# EAGLE design Water_ECMeter-M0 (EAGLE 7.2.0)
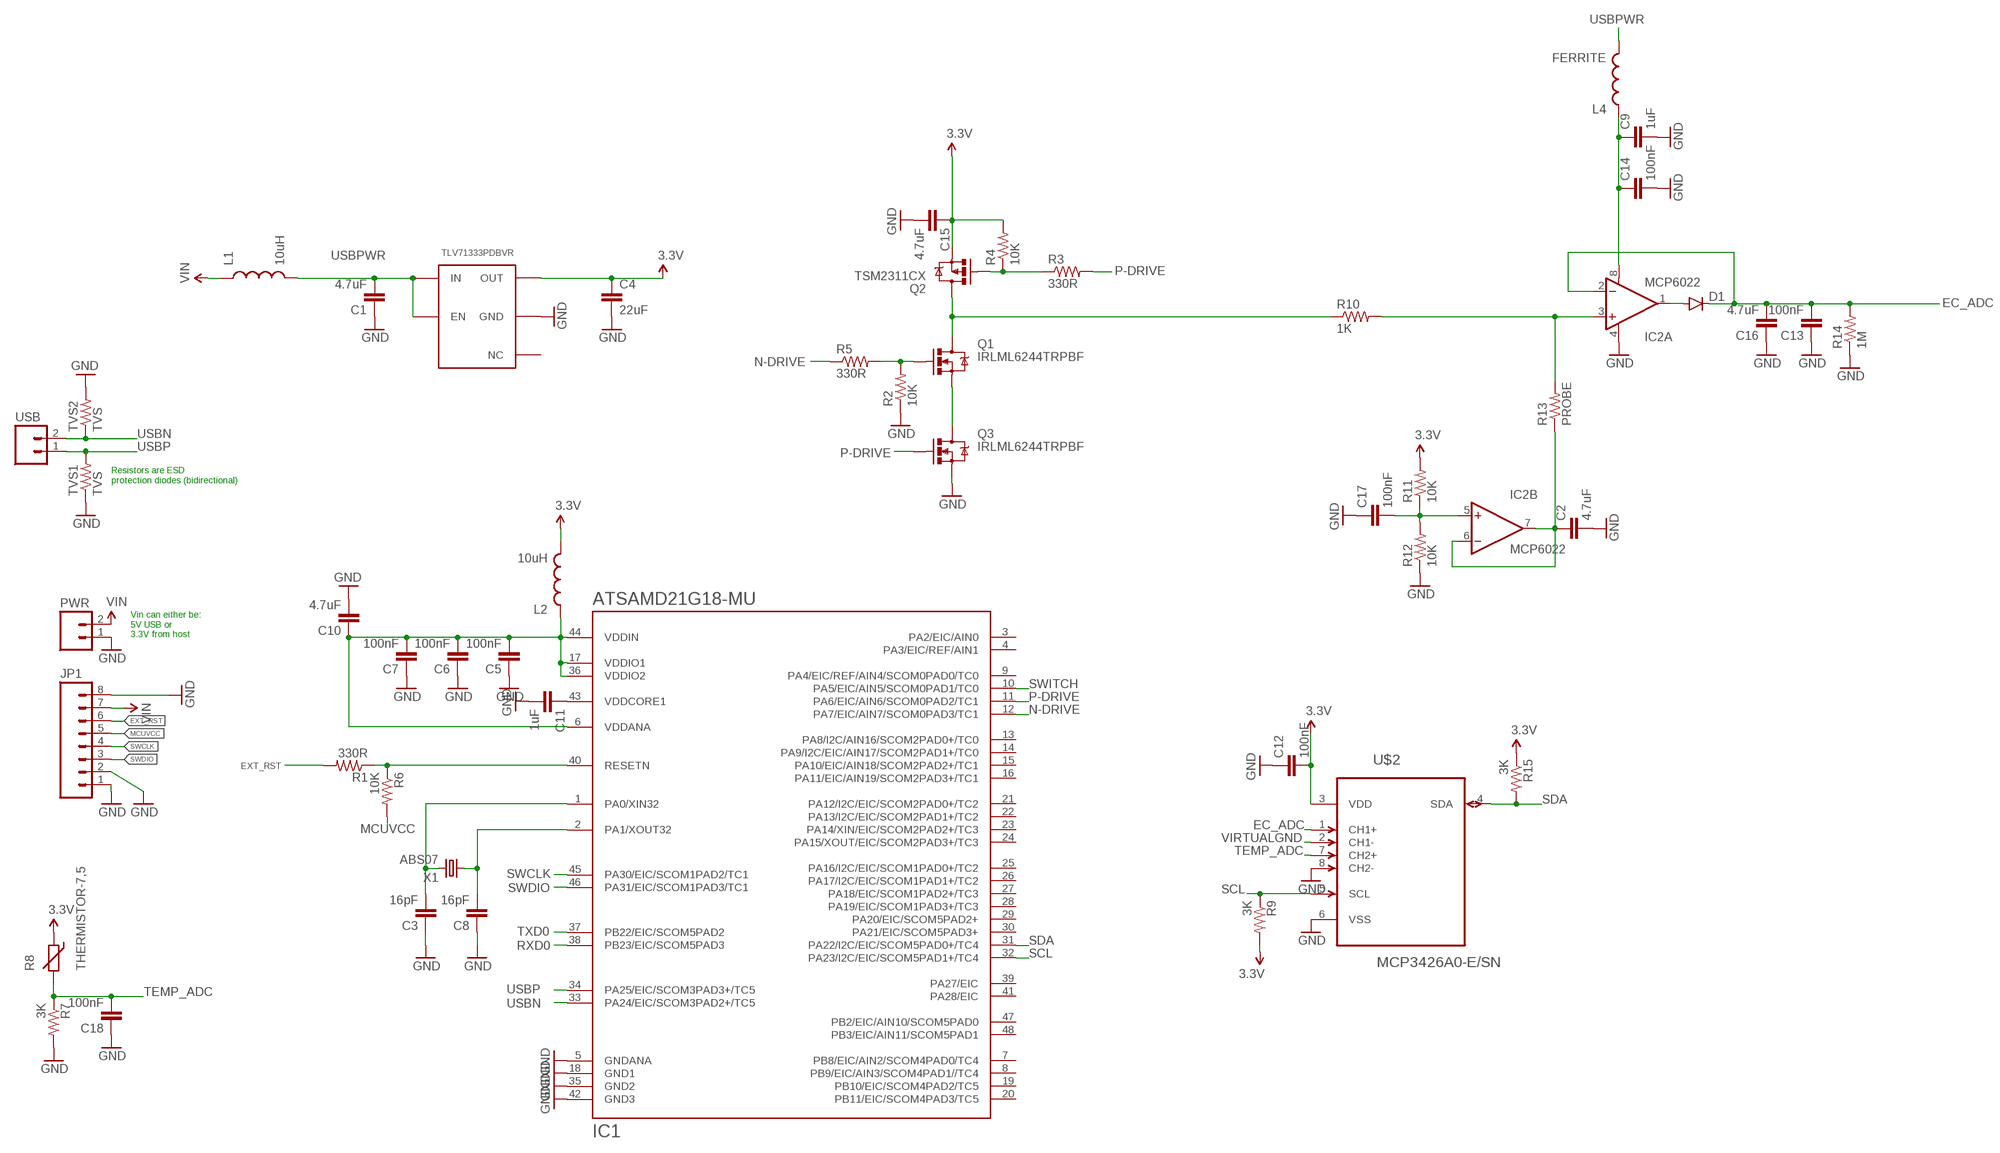
[diagram p0: schematic, sheet 1]

## Parts
C1  4.7uF  CAP0603-CAP  [0603-CAP]
C2  4.7uF  CAP0603-CAP  [0603-CAP]
C3  16pF  CAP0402-CAP  [0402-CAP]
C4  22uF  CAP1206  [1206]
C5  100nF  CAP0402-CAP  [0402-CAP]
C6  100nF  CAP0402-CAP  [0402-CAP]
C7  100nF  CAP0402-CAP  [0402-CAP]
C8  16pF  CAP0402-CAP  [0402-CAP]
C9  1uF  CAP0402-CAP  [0402-CAP]
C10  4.7uF  CAP0603-CAP  [0603-CAP]
C11  1uF  CAP0402-CAP  [0402-CAP]
C12  100nF  CAP0402-CAP  [0402-CAP]
C13  100nF  CAP0402-CAP  [0402-CAP]
C14  100nF  CAP0402-CAP  [0402-CAP]
C15  4.7uF  CAP0603-CAP  [0603-CAP]
C16  4.7uF  CAP0603-CAP  [0603-CAP]
C17  100nF  CAP0402-CAP  [0402-CAP]
C18  100nF  CAP0402-CAP  [0402-CAP]
D1  DIODESOD123  [SOD-123]
IC1  ATSAMD21G18-MU  [QFN48]
IC2  MCP6022  OPAMP-DUALU  [SO08]
JP1  M08  [1X08_ROUND]
L1  10uH  INDUCTOR0603  [0603]
L2  10uH  INDUCTOR0603  [0603]
L4  FERRITE  INDUCTOR0603  [0603]
PWR  M02LOCK_LONGPADS  [1X02_LOCK_LONGPADS]
Q1  IRLML6244TRPBF  MOSFET-NCHANNELAO3404A  [SOT23-3]
Q2  TSM2311CX  MOSFET-PCHANNEL  [SOT23-3]
Q3  IRLML6244TRPBF  MOSFET-NCHANNELAO3404A  [SOT23-3]
R1  330R  RESISTOR0402-RES  [0402-RES]
R2  10K  RESISTOR0402-RES  [0402-RES]
R3  330R  RESISTOR0402-RES  [0402-RES]
R4  10K  RESISTOR0402-RES  [0402-RES]
R5  330R  RESISTOR0402-RES  [0402-RES]
R6  10K  RESISTOR0402-RES  [0402-RES]
R7  3K  RESISTOR0402-RES  [0402-RES]
R8  THERMISTOR-7,5  [R-7,5]
R9  3K  RESISTOR0402-RES  [0402-RES]
R10  1K  RESISTOR0805-RES  [0805]
R11  10K  RESISTOR0402-RES  [0402-RES]
R12  10K  RESISTOR0402-RES  [0402-RES]
R13  PROBE  RESISTORPTH-1W  [AXIAL-0.6]
R14  1M  RESISTOR0402-RES  [0402-RES]
R15  3K  RESISTOR0402-RES  [0402-RES]
TVS1  TVS  RESISTOR0402-RES  [0402-RES]
TVS2  TVS  RESISTOR0402-RES  [0402-RES]
U$1  TLV71333PDBVR  [TLV71333PDBVR]
U$2  MCP3426A0-E/SN  [SOIC127P600X175-8N]
USB  M02LOCK_LONGPADS  [1X02_LOCK_LONGPADS]
X1  ABS07  [ABS07]

## Nets
3.3V: C4.1 C12.2 C15.1 L2.2 Q2.2(S) R4.2 R8.1 R9.2 R11.2 R15.1 U$1.P$5(OUT) U$2.3(VDD)
EC_ADC: C13.2 C16.2 D1.C IC2.2(A:-IN) R14.2 U$2.1(CH1+)
EXT_RST: JP1.6 R1.2
GND: C1.1 C2.2 C3.1 C4.2 C5.1 C6.1 C7.1 C8.1 C9.2 C10.2 C11.2 C12.1 C13.1 C14.2 C15.2 C16.1 C17.1 C18.1 IC1.5(GNDANA) IC1.18(GND1) IC1.35(GND2) IC1.42(GND3) IC2.4(A:V-) JP1.1 JP1.2 JP1.8 PWR.1 Q3.2(S) R2.1 R7.2 R12.1 R14.1 TVS1.1 TVS2.2 U$1.P$2(GND) U$2.6(VSS) U$2.8(CH2-)
MCUVCC: C5.2 C6.2 C7.2 C10.1 IC1.6(VDDANA) IC1.17(VDDIO1) IC1.36(VDDIO2) IC1.44(VDDIN) JP1.5 L2.1 R6.2
N$1: D1.A IC2.1(A:OUT)
N$2: IC1.40(RESETN) R1.1 R6.1
N$3: C3.2 IC1.1(PA0/XIN32) X1.P$2
N$4: C11.1 IC1.43(VDDCORE1)
N$5: C8.2 IC1.2(PA1/XOUT32) X1.P$1
N$6: Q2.1(G) R3.1 R4.1
N$7: Q1.2(S) Q3.3(D)
N$8: Q1.3(D) Q2.3(D) R10.1
N$9: Q1.1(G) R2.2 R5.2
N$13: IC2.3(A:+IN) R10.2 R13.P$2
N$14: C17.2 IC2.5(B:+IN) R11.1 R12.2
N$16: C9.1 C14.1 IC2.8(A:V+) L4.1
N-DRIVE: IC1.12(PA7/EIC/AIN7/SCOM0PAD3/TC1) R5.1
P-DRIVE: IC1.11(PA6/EIC/AIN6/SCOM0PAD2/TC1) Q3.1(G) R3.2
RXD0: IC1.38(PB23/EIC/SCOM5PAD3)
SCL: IC1.32(PA23/I2C/EIC/SCOM5PAD1+/TC4) R9.1 U$2.5(SCL)
SDA: IC1.31(PA22/I2C/EIC/SCOM5PAD0+/TC4) R15.2 U$2.4(SDA)
SWCLK: IC1.45(PA30/EIC/SCOM1PAD2/TC1) JP1.4
SWDIO: IC1.46(PA31/EIC/SCOM1PAD3/TC1) JP1.3
SWITCH: IC1.10(PA5/EIC/AIN5/SCOM0PAD1/TC0)
TEMP_ADC: C18.2 R7.1 R8.2 U$2.7(CH2+)
TXD0: IC1.37(PB22/EIC/SCOM5PAD2)
USBN: IC1.33(PA24/EIC/SCOM3PAD2+/TC5) TVS2.1 USB.2
USBP: IC1.34(PA25/EIC/SCOM3PAD3+/TC5) TVS1.2 USB.1
USBPWR: C1.2 L1.2 L4.2 U$1.P$1(IN) U$1.P$3(EN)
VIN: JP1.7 L1.1 PWR.2
VIRTUALGND: C2.1 IC2.6(B:-IN) IC2.7(B:OUT) R13.P$1 U$2.2(CH1-)
Unconnected: IC1.3(PA2/EIC/AIN0) IC1.4(PA3/EIC/REF/AIN1) IC1.7(PB8/EIC/AIN2/SCOM4PAD0/TC4) IC1.8(PB9/EIC/AIN3/SCOM4PAD1//TC4) IC1.9(PA4/EIC/REF/AIN4/SCOM0PAD0/TC0) IC1.13(PA8/I2C/AIN16/SCOM2PAD0+/TC0) IC1.14(PA9/I2C/EIC/AIN17/SCOM2PAD1+/TC0) IC1.15(PA10/EIC/AIN18/SCOM2PAD2+/TC1) IC1.16(PA11/EIC/AIN19/SCOM2PAD3+/TC1) IC1.19(PB10/EIC/SCOM4PAD2/TC5) IC1.20(PB11/EIC/SCOM4PAD3/TC5) IC1.21(PA12/I2C/EIC/SCOM2PAD0+/TC2) IC1.22(PA13/I2C/EIC/SCOM2PAD1+/TC2) IC1.23(PA14/XIN/EIC/SCOM2PAD2+/TC3) IC1.24(PA15/XOUT/EIC/SCOM2PAD3+/TC3) IC1.25(PA16/I2C/EIC/SCOM1PAD0+/TC2) IC1.26(PA17/I2C/EIC/SCOM1PAD1+/TC2) IC1.27(PA18/EIC/SCOM1PAD2+/TC3) IC1.28(PA19/EIC/SCOM1PAD3+/TC3) IC1.29(PA20/EIC/SCOM5PAD2+) IC1.30(PA21/EIC/SCOM5PAD3+) IC1.39(PA27/EIC) IC1.41(PA28/EIC) IC1.47(PB2/EIC/AIN10/SCOM5PAD0) IC1.48(PB3/EIC/AIN11/SCOM5PAD1) U$1.P$4(NC)

## Notes on the sheet
- Resistors are ESD
  protection diodes (bidirectional)
- Vin can either be:
  5V USB or
  3.3V from host

## Library data of the parts
C1-C3 C5-C18 = SparkFun-Passives:CAP: Capacitor Standard 0603 ceramic capacitor, and 0.1" leaded capacitor.
C4 = SparkFun-Capacitors:CAP: Capacitor Standard 0603 ceramic capacitor, and 0.1" leaded capacitor.
D1 = SparkFun-DiscreteSemi:DIODE: Diode These are standard reverse protection diodes and small signal diodes. SMA package can handle up to about 1A. SOD-323 can handle about 200mA. What the SOD-323 package when ordering, there are some mfgs out there that are 5-pin packages.
IC1 = gknff:ATSAMD21G18
IC2 = SparkFun-AnalogIC:OPAMP-DUAL: Generic op-amp footprint
JP1 = SparkFun-Connectors:M08: Header 8 Standard 8-pin 0.1" header. Use with straight break away headers (SKU : PRT-00116), right angle break away headers (PRT-00553), swiss pins (PRT-00743), machine pins (PRT-00117), and female headers (PRT-00115).
L1 L2 L4 = SparkFun-Passives:INDUCTOR: Inductors Basic Inductor/Choke - 0603 and 1206. Footprints are not proven and vary greatly between part numbers. INDUCTOR POWER 3.3UH 4.0A SMD 0.197" L x 0.197" W x 0.177" H (5.00mm x 5.00mm x 4.50mm)
PWR USB = SparkFun-Connectors:M02: Standard 2-pin 0.1" header. Use with - straight break away headers ( PRT-00116) - right angle break away headers (PRT-00553) - swiss pins (PRT-00743) - machine pins (PRT-00117) - female headers (PRT-00115) Molex polarized connector foot print use with: PRT-08233 with associated crimp pins and housings. 2.54_SCREWTERM for use with PRT-10571. 3.5mm Screw Terminal footprints for PRT-08084 5mm Screw Terminal footprints for use with PRT-08432
Q1 Q3 = SparkFun-DiscreteSemi:MOSFET-NCHANNEL: Common NMOSFET Parts MFG P/N Store ID Prod ID FDD8780 TRANS-09984 SI7820DN TRANS-11055 FDS6630A IC-08089 2N7002PW TRANS-11151 FQP30N06L COM-10213 TRANS-10060 BSS123LT1G TRANS-08345 BSS138 TRANS-00830 BS170 2N7000; PROD_ID: TRAN-12988
Q2 = SparkFun-DiscreteSemi:MOSFET-PCHANNEL: Generic PMOSFET IRLML2244 - TRANS-11153 (SOT-23 -20V -4.3A) (1.Gate 2.Source 3.Drain) FQP27P06 - COM-10349 <http://www.sparkfun.com/products/10349> (TO-220 -60V -27A) (1.Gate 2.Source 3.Drain); PROD_ID: TRANS-08285
R1-R7 R9-R15 TVS1 TVS2 = SparkFun-Passives:RESISTOR: Resistor Basic schematic elements and footprints for 0603, 1206, and PTH resistors.
R8 = varistor:THERMISTOR: THERMISTOR
U$1 = m2m4all:TLV71333PDBVR
U$2 = m2m4all:MCP3426A0-E/SN: Analog-to-Digital Converter; MPN: MCP3426A0-E/SN; OC_FARNELL: 1825012; OC_NEWARK: 52R9954; PACKAGE: SOIC-8; SUPPLIER: Microchip
X1 = m2m4all:ABS07

## Board
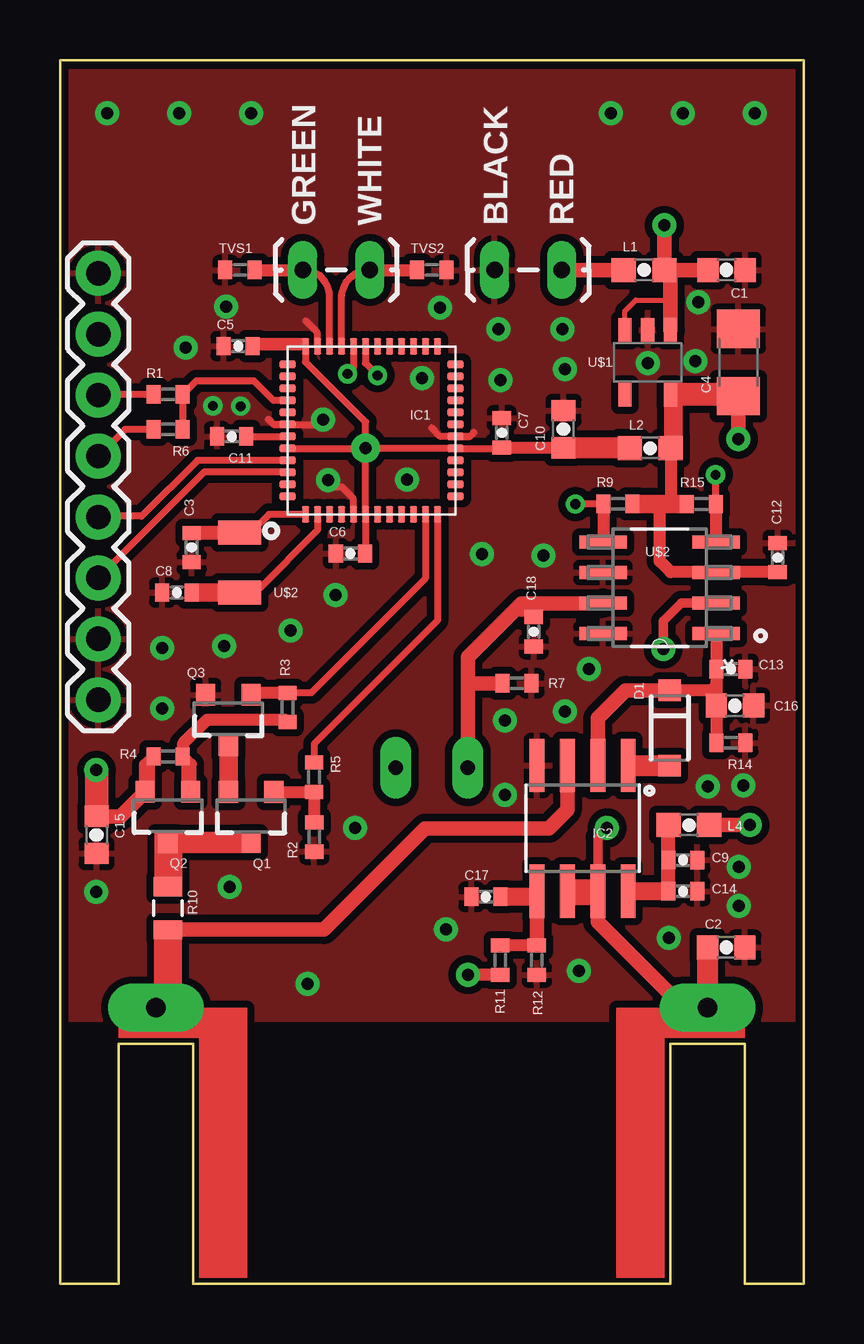
[diagram p1: board, top side]
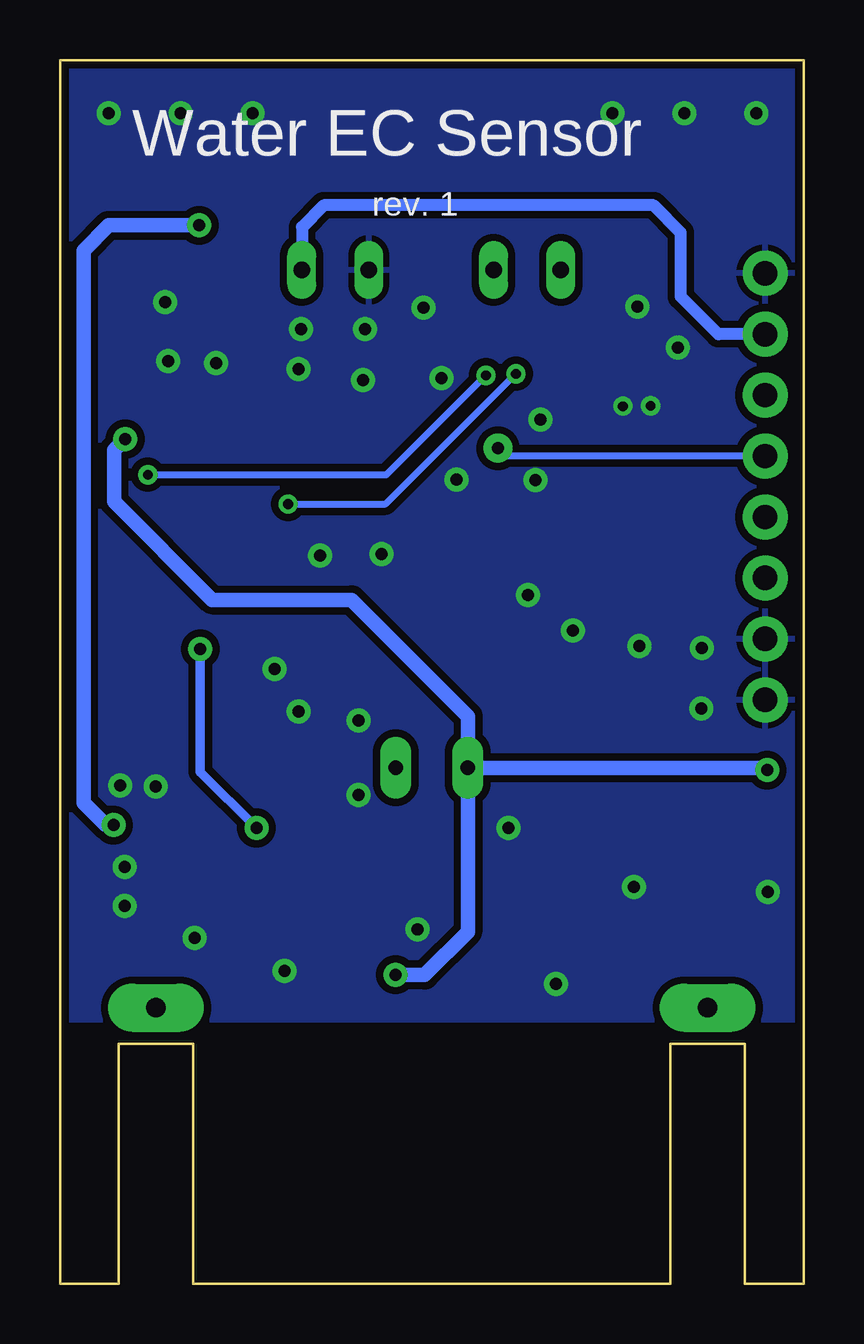
[diagram p2: board, bottom side, seen from below]

Size 31 x 51 mm. Coordinates in mm from the lower left corner, seen from the top.
Outline: 5.55,0 25.45,0 25.45,10 28.55,10 28.55,0 31,0 31,51 0,51 0,0 2.45,0 2.45,10 5.55,10 5.55,0
Copper layers (1*16): Top 0.035mm / dielectric 1.5mm / Bottom 0.035mm
Design rules "default *": minimum track width 10mil, minimum drill 24mil, track to track 12mil, track to pad 12mil, pad to pad 12mil, via to via 12mil, smd to smd 12mil, copper to edge 12mil, drill to drill 8mil, minimum pad ring 10mil, minimum via ring 8mil, stop-mask expansion 4mil, vias tented up to drill 20mil, thermal gap 10mil

### Footprints (pad centres in the part's own frame; a part is rotated, then mirrored left to right if it is on the bottom)
0603-CAP = smd 0.889 x 1: 1 -0.774,0; 2 0.774,0
0402-CAP = smd 0.584 x 0.762: 1 -0.61,0; 2 0.61,0
1206 = smd 1.6 x 1.8: 1 -1.4,0; 2 1.4,0
SOD-123 = smd 0.9 x 0.95: A 1.575,0; C -1.575,0
QFN48 = smd 0.3 x 0.7: 1 -2.75,-3.5; 2 -2.25,-3.5; 3 -1.75,-3.5; 4 -1.25,-3.5; 5 -0.75,-3.5; 6 -0.25,-3.5; 7 0.25,-3.5; 8 0.75,-3.5; 9 1.25,-3.5; 10 1.75,-3.5; 11 2.25,-3.5; 12 2.75,-3.5; 25 2.75,3.5; 26 2.25,3.5; 27 1.75,3.5; 28 1.25,3.5; 29 0.75,3.5; 30 0.25,3.5; 31 -0.25,3.5; 32 -0.75,3.5; 33 -1.25,3.5; 34 -1.75,3.5; 35 -2.25,3.5; 36 -2.75,3.5 | smd 0.7 x 0.3: 13 3.5,-2.75; 14 3.5,-2.25; 15 3.5,-1.75; 16 3.5,-1.25; 17 3.5,-0.75; 18 3.5,-0.25; 19 3.5,0.25; 20 3.5,0.75; 21 3.5,1.25; 22 3.5,1.75; 23 3.5,2.25; 24 3.5,2.75; 37 -3.5,2.75; 38 -3.5,2.25; 39 -3.5,1.75; 40 -3.5,1.25; 41 -3.5,0.75; 42 -3.5,0.25; 43 -3.5,-0.25; 44 -3.5,-0.75; 45 -3.5,-1.25; 46 -3.5,-1.75; 47 -3.5,-2.25; 48 -3.5,-2.75
SO08 = smd 0.61 x 2.21: 1 -1.905,-2.616; 2 -0.635,-2.616; 3 0.635,-2.616; 4 1.905,-2.616; 5 1.905,2.616; 6 0.635,2.616; 7 -0.635,2.616; 8 -1.905,2.616
1X08_ROUND = drill 1.016 pad 1.88: 1 0,0; 2 2.54,0; 3 5.08,0; 4 7.62,0; 5 10.16,0; 6 12.7,0; 7 15.24,0; 8 17.78,0
0603 = smd 1.016 x 1: 1 -0.85,0; 2 0.85,0
1X02_LOCK_LONGPADS = drill 0.7 long: 1 -1.377,0; 2 1.417,0
SOT23-3 = smd 0.8 x 0.9: 1 -0.95,-1; 2 0.95,-1; 3 0,1.1
0402-RES = smd 0.584 x 0.762: 1 -0.61,0; 2 0.61,0
R-7,5 = drill 0.6 pad 1.3 long: 1 -1.5,0; 2 1.5,0
0805 = smd 0.8 x 1.2: 1 -0.9,0; 2 0.9,0
AXIAL-0.6 = drill 0.8 pad 2 long: P$1 -11.5,0; P$2 11.5,0
TLV71333PDBVR = smd 0.55 x 1: P$1 -0.95,-1.35; P$2 0,-1.35; P$3 0.95,-1.35; P$4 0.95,1.35; P$5 -0.95,1.35
SOIC127P600X175-8N = smd 1.981 x 0.559: 1 -2.362,1.905; 2 -2.362,0.635; 3 -2.362,-0.635; 4 -2.362,-1.905; 5 2.362,-1.905; 6 2.362,-0.635; 7 2.362,0.635; 8 2.362,1.905
ABS07 = smd 1 x 1.8: P$1 1.25,0; P$2 -1.25,0

### Placement (x,y rotation side)
C1  27.79,42.25 180 top
C2  27.78,14.01 0 top
C3  5.49,30.68 90 top
C4  28.28,38.39 90 top
C5  7.43,39.07 0 top
C6  12.11,30.43 0 top
C7  18.42,35.46 270 top
C8  4.87,28.8 0 top
C9  25.97,17.65 0 top
C10  20.99,35.61 90 top
C11  7.16,35.31 180 top
C12  29.92,30.26 270 top
C13  27.97,25.61 180 top
C14  25.97,16.35 0 top
C15  1.53,18.7 270 top
C16  28.14,24.09 180 top
C17  17.76,16.12 0 top
C18  19.75,27.17 90 top
D1  25.42,23.16 270 top
IC1  12.99,35.56 0 top
IC2  21.79,18.97 180 top
JP1  1.6,24.33 90 top
L1  24.35,42.25 0 top
L2  24.61,34.82 0 top
L4  26.22,19.11 0 top
PWR  19.5,42.25 0 top
Q1  7.97,19.49 180 top
Q2  4.5,19.5 180 top
Q3  7.02,23.54 180 top
R1  4.51,37.06 180 top
R2  10.6,18.61 90 top
R3  9.49,24.01 90 top
R4  4.51,21.97 180 top
R5  10.6,21.11 270 top
R6  4.51,35.6 180 top
R7  19.05,25.02 0 top
R8  15.5,21.5 0 top
R9  23.26,32.5 0 top
R10  4.5,15.64 270 top
R11  18.35,13.48 270 top
R12  19.88,13.48 90 top
R13  15.5,11.5 180 top
R14  27.97,22.54 180 top
R15  26.74,32.49 0 top
TVS1  7.5,42.25 0 top
TVS2  15.5,42.25 0 top
U$1  24.5,38.4 180 top
U$2  25,29 180 top
USB  11.5,42.25 0 top
X1  7.49,30.05 270 top

### Tracks (layer width: path | path; a pad name or v marks a point on that pad's centre or on a via)
3.3V  (via drill 0.5 pad 1)
  Top 0.4: U$1.P$5 arc90 25.51,36.99 | 25.51,36.99 C4.1 | 25.51,36.99 arc90 25.46,36.94 L2.2
  Top 0.5: C12.2 27.38,29.65 | 27.38,29.65 U$2.3 | R9.2 25,32.5 | 25,32.5 25.5,32.5 | 25.5,32.5 R15.1 | L2.2 25.46,32.54 25.5,32.5 | 27.38,29.65 25.46,29.65 25,30.11 25,32.5 | Q2.2 3.55,21.62 R4.2 | R11.2 v17.01,12.87 | v17.01,12.87
  Top 0.6: Q2.2 2.52,19.47 C15.1 1.52,19.48 v1.52,21.4 | C4.1 v28.28,35.2
  Bottom 0.6: v28.28,35.2 28.74,34.74 28.74,32.59 24.65,28.5 18.84,28.5 13.98,23.64 13.98,21.52 R8.1 | v1.52,21.4 1.62,21.5 R8.1 | R8.1 14,14.66 15.8,12.86 v17,12.86 v17.01,12.87
EC_ADC
  Top 0.5: U$2.1 C13.2 27.36,25 | 27.36,25 C16.2 R14.2 | D1.C 27.1,24.73 arc90 27.36,25
  Top 0.6: IC2.2 22.43,23.57 23.58,24.72 25.41,24.72 D1.C
EXT_RST
  Top 0.3: R1.2 1.63,37.06 JP1.6
GND  (via drill 0.4 pad 0.8, 0.5 pad 1)
  Top 0.3: IC1.5 12.24,32.71 11.75,33.2 11.48,33.2 v11.18,33.5 | IC1.35 10.74,39.63 10.24,40.13 | 10.76,35.81 arc90 v10.97,36.02 10.76,35.81 8.91,35.81 8.69,36.03 8.68,36.03 8.9,35.81 IC1.42 | IC1.18 17.09,35.31 17.25,35.47 17.25,35.46 17.1,35.31 15.85,35.31 15.49,35.67
  other vias: 24.5,38.36 14.46,33.51 15.1,37.73 6.38,36.59 7.53,36.57 28.48,20.77 27.02,20.71 28.3,17.37 28.3,15.73 25.38,14.41 21.63,13.04 16.1,14.77 1.5,16.33 4.26,23.97 4.25,26.5 6.84,26.58 21.05,23.85 20.16,30.34 17.59,30.41 11.49,28.69 5.23,39.01 6.93,40.72 15.84,40.68 18.37,37.66 21.05,38.11 18.29,39.79 20.94,39.79 26.49,38.44 26.62,40.91 7.07,16.53 1.97,48.78 4.97,48.78 7.97,48.78 22.97,48.78 25.97,48.78 28.97,48.78 12.31,19 10.33,12.48 9.62,27.21 18.56,20.36 18.56,23.46 22.05,25.61
  pour Top: -0.5,51.5 32,51.5 32,11 -1,11 -1,51.5
  pour Bottom: -1,51.5 32,51.5 32,11 -1,11
MCUVCC  (via drill 0.5 pad 1.2)
  Top 0.3: 23.75,34.83 arc-90 L2.1 | 18.28,34.83 arc90 C7.2 arc90 18.26,34.81 IC1.17 v12.75,34.81 v12.74,34.82 | C5.2 IC1.36 10.24,38.41 12.74,35.91 v12.74,34.82 | v12.74,34.82 IC1.6 12.74,30.58 C6.2 | IC1.44 v12.73,34.81 v12.74,34.82 | R6.2 2.71,35.6 JP1.5
  Top 0.5: 18.28,34.83 C10.1 23.74,34.84 L2.1
  Bottom 0.3: JP1.5 12.41,34.49 v12.74,34.82
N$1
  Top 0.3: IC2.1 D1.A
N$2
  Top 0.3: IC1.40 8.9,36.81 8.09,37.62 5.68,37.62 R1.1 R6.1
N$3
  Top 0.3: IC1.1 8.71,32.06 8.03,31.38 7.57,31.38 X1.P$2 C3.2
N$4
  Top 0.3: C11.1 IC1.43
N$5
  Top 0.3: IC1.2 10.74,31.4 8.23,28.89 7.58,28.89 X1.P$1 C8.2
N$6
  Top 0.5: R3.1 9.39,23.5 6.14,23.5 5.12,22.48 R4.1 | R4.1 | Q2.1 5.45,21.64 R4.1
N$7
  Top 0.5: Q3.3 Q1.2
N$8
  Top 0.5: Q1.3 Q2.3 R10.1
N$9
  Top 0.5: Q1.1 10.59,20.49 R5.2 R2.2
N$13
  Top 0.6: R13.P$2 4.5,12 R10.2 4.52,14.76 11.01,14.76 15.22,18.97 20.39,18.97 21.16,19.73 IC2.3
N$14
  Top 0.406: C17.2 19.88,16.12 IC2.5
  Top 0.5: R12.2 R11.1
  Top 0.6: IC2.5 R12.2
N$16
  Top 0.3: L4.1 25.36,18.98 C9.1 C14.1 IC2.8
N-DRIVE
  Top 0.3: IC1.12 15.74,27.63 10.6,22.49 R5.1
P-DRIVE
  Top 0.3: IC1.11 15.24,29.39 10.47,24.62 R3.2 | R3.2
  Top 0.5: R3.2 8.05,24.62 Q3.1
SCL  (via drill 0.4 pad 0.8)
  Top 0.3: R9.1 v21.49,32.49 | IC1.32 12.24,38.17 v11.99,37.92
  Top 0.5: R9.1 U$2.5
  Bottom 0.3: v21.49,32.49 17.42,32.49 v11.99,37.92
SDA  (via drill 0.4 pad 0.8)
  Top 0.3: R15.2 v27.35,33.7 v27.34,33.71 | IC1.31 12.74,38.36 v13.24,37.86
  Top 0.5: R15.2 U$2.4
  Bottom 0.3: v27.34,33.71 17.39,33.71 v13.24,37.86
SWCLK
  Top 0.3: IC1.45 5.73,34.31 3.4,31.98 1.63,31.98 JP1.4
SWDIO
  Top 0.3: IC1.46 9.41,33.81 9.39,33.83 6.02,33.83 JP1.3
TEMP_ADC
  Top 0.2: C18.2 19.6,27.78 19.6,28.35
  Top 0.6: R8.2 17,25.02 | 17,25.02 17,26.11 19.24,28.35 19.6,28.35 22.62,28.35 U$2.7 | R7.1 17,25.02
USBN
  Top 0.3: IC1.33 11.74,41.07 arc-90 USB.2
  Top 0.5: USB.2 TVS2.1
USBP
  Top 0.3: IC1.34 11.24,41.13 arc90 USB.1
  Top 0.5: TVS1.2 USB.1
USBPWR  (via drill 0.5 pad 1)
  Top 0.2: U$1.P$3 23.55,40.54 24.01,41 25.4,41 25.45,41.05
  Top 0.6: L1.2 C1.2 | U$1.P$1 25.45,41.05 25.45,42 L1.2 | v25.2,44.11 L1.2 | v28.77,19.11 L4.2
  Bottom 0.6: v25.2,44.11 28.97,44.11 30.02,43.06 30.02,20.03 29.1,19.11 v28.77,19.11
VIN
  Top 0.6: PWR.2 L1.1
  Bottom 0.5: JP1.7 3.55,39.57 5.12,41.14 5.12,43.81 6.25,44.94 20.01,44.94 20.91,44.04 PWR.2
VIRTUALGND  (via drill 0.5 pad 1)
  Top 0.4: U$2.2 25.91,28.36 25.15,27.61 v25.15,26.45 | v22.81,18.99 22.43,18.61 IC2.7
  Top 0.6: C2.1 R13.P$1 26.98,11.48 26.01,11.48 22.43,15.06 IC2.7 IC2.6
  Bottom 0.4: v25.15,26.45 25.15,21.33 v22.81,18.99
(copper drawn outside any net)
  shapes: Top area x31

### Text on the board
bPlace: Water EC Sensor | rev. 1
tNames: GREEN | WHITE | BLACK | RED | U$1 | IC1 | U$2 | U$2
tDocu: GND | +5V | RESET | VSENSE | SWCLK | SWDIO | GND | VIA GUIDELINES: / / Normal traces: / 0.4mm hole | 0.8mm diameter / / Power traces: / 0.5mm hole | 1mm diameter | GND